# Altium schematic sheet Inputs.SchDoc
size A4; SheetNumber: 1; SheetTotal: 2
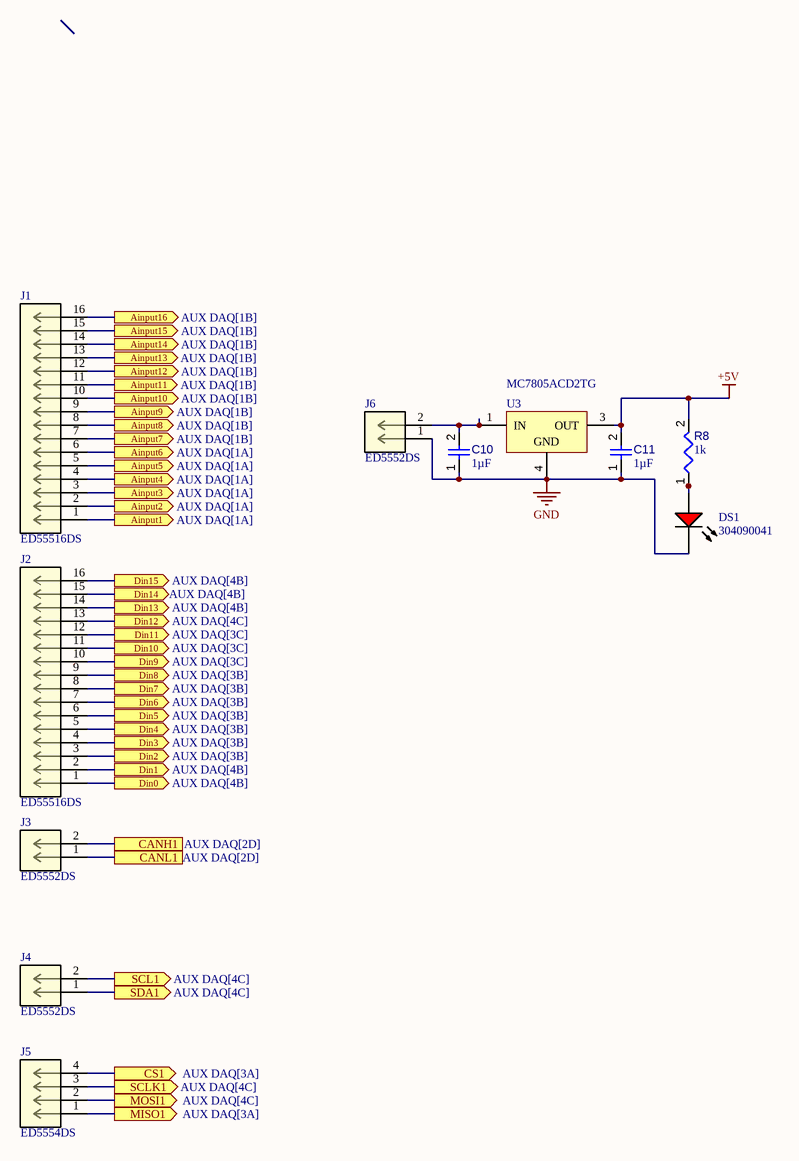
[diagram p0: Inputs.SchDoc]

## Parts
C10  value 1µF  [CAPC3216X180X20ML20]  (hidden comment: Capacitor 1 uF +/- 10% 25 V 1206)
C11  value 1µF  [CAPC3216X180X20ML20]  (hidden comment: Capacitor 1 uF +/- 10% 25 V 1206)
DS1  304090041  [LED-2P-2.28-3MM_A]  (no BOM)
J1  ED55516DS  [CONN16_ED555_56X6P5_OST]  (no BOM)
J2  ED55516DS  [CONN16_ED555_56X6P5_OST]  (no BOM)
J3  ED5552DS  [CONN_ED5552DS_OST]  (no BOM)
J4  ED5552DS  [CONN_ED5552DS_OST]  (no BOM)
J5  ED5554DS  [CONN4_ED5554DS_SHT]  (no BOM)
J6  ED5552DS  [CONN_ED5552DS_OST]
R8  value 1k  [RESC0805(2012)_L]  (hidden comment: Resistor 1K +/-5% 0805 125 mW)
U3  MC7805ACD2TG  [ONSC-D2PAK-3-936-03_V]  (no BOM)

## Ports
Ainput1 (out, see AUX DAQ[1A]), Ainput2 (out, see AUX DAQ[1A]), Ainput3 (out, see AUX DAQ[1A]), Ainput4 (out, see AUX DAQ[1A]), Ainput5 (out, see AUX DAQ[1A]), Ainput6 (out, see AUX DAQ[1A]), Ainput7 (out, see AUX DAQ[1B]), Ainput8 (out, see AUX DAQ[1B]), Ainput9 (out, see AUX DAQ[1B]), Ainput10 (out, see AUX DAQ[1B]), Ainput11 (out, see AUX DAQ[1B]), Ainput12 (out, see AUX DAQ[1B]), Ainput13 (out, see AUX DAQ[1B]), Ainput14 (out, see AUX DAQ[1B]), Ainput15 (out, see AUX DAQ[1B]), Ainput16 (out, see AUX DAQ[1B]), CANH1 (see AUX DAQ[2D]), CANL1 (see AUX DAQ[2D]), CS1 (out, see AUX DAQ[3A]), Din0 (out, see AUX DAQ[4B]), Din1 (out, see AUX DAQ[4B]), Din2 (out, see AUX DAQ[3B]), Din3 (out, see AUX DAQ[3B]), Din4 (out, see AUX DAQ[3B]), Din5 (out, see AUX DAQ[3B]), Din6 (out, see AUX DAQ[3B]), Din7 (out, see AUX DAQ[3B]), Din8 (out, see AUX DAQ[3B]), Din9 (out, see AUX DAQ[3C]), Din10 (out, see AUX DAQ[3C]), Din11 (out, see AUX DAQ[3C]), Din12 (out, see AUX DAQ[4C]), Din13 (out, see AUX DAQ[4B]), Din14 (out, see AUX DAQ[4B]), Din15 (out, see AUX DAQ[4B]), MISO1 (out, see AUX DAQ[3A]), MOSI1 (out, see AUX DAQ[4C]), SCL1 (out, see AUX DAQ[4C]), SCLK1 (out, see AUX DAQ[4C]), SDA1 (out, see AUX DAQ[4C])

## Nets
+5V: C11.2 R8.2 U3.3(OUT)
GND: C10.1 C11.1 DS1.2(K) J6.1 U3.4(GND)
Ainput1: J1.1 ; port Ainput1
Ainput2: J1.2 ; port Ainput2
Ainput3: J1.3 ; port Ainput3
Ainput4: J1.4 ; port Ainput4
Ainput5: J1.5 ; port Ainput5
Ainput6: J1.6 ; port Ainput6
Ainput7: J1.7 ; port Ainput7
Ainput8: J1.8 ; port Ainput8
Ainput9: J1.9 ; port Ainput9
Ainput10: J1.10 ; port Ainput10
Ainput11: J1.11 ; port Ainput11
Ainput12: J1.12 ; port Ainput12
Ainput13: J1.13 ; port Ainput13
Ainput14: J1.14 ; port Ainput14
Ainput15: J1.15 ; port Ainput15
Ainput16: J1.16 ; port Ainput16
CANH1: J3.2 ; port CANH1
CANL1: J3.1 ; port CANL1
CS1: J5.4 ; port CS1
Din0: J2.1 ; port Din0
Din1: J2.2 ; port Din1
Din2: J2.3 ; port Din2
Din3: J2.4 ; port Din3
Din4: J2.5 ; port Din4
Din5: J2.6 ; port Din5
Din6: J2.7 ; port Din6
Din7: J2.8 ; port Din7
Din8: J2.9 ; port Din8
Din9: J2.10 ; port Din9
Din10: J2.11 ; port Din10
Din11: J2.12 ; port Din11
Din12: J2.13 ; port Din12
Din13: J2.14 ; port Din13
Din14: J2.15 ; port Din14
Din15: J2.16 ; port Din15
MISO1: J5.1 ; port MISO1
MOSI1: J5.2 ; port MOSI1
SCL1: J4.2 ; port SCL1
SCLK1: J5.3 ; port SCLK1
SDA1: J4.1 ; port SDA1
NetC10_2: C10.2 J6.2 U3.1(IN)
NetDS1_1: DS1.1(A) R8.1

## Library data of the parts
C10 C11 = CMP-001-00006-6: Chip Capacitor, 1 uF, +/- 10%, 25 V, 1206 (3216 Metric); Capacitor Type: Ceramic; Voltage Rating: 25V; Tolerance: 10%; Min Operating Temperature: -55°C; Pins: 2; Case/Package: 1206; Max Operating Temperature: 125°C; Mounting Technology: SM; RoHS Compliant: True
DS1 = CMP-007-00007-2: Red LED, 80 mW, 30 mA, -25 to 85 degC, 2-Pin THD; Manufacturer: Shenzhen CGX; Package Description: 2-Pin Through Hole Device, Dia 3 mm, Pitch 2.28 mm; Datasheet URL: http://datasheet.octopart.com/304090041-Chengguangxing-datasheet-62330656.pdf; Mounting Technology: TH; Manufacturer URL: http://szcgx.com/; RoHS Compliant: Unknown; Datasheet Version: Sep-14; Case/Package: 304090041; Package Reference: 304090041
J1 J2 = CMP-012-000000-1: No Description Available; Mfr_Name: On Shore Technology; Type: Type; Design Item ID: ED55516DS; RefDes: RefDes; Source: ED55516DS.SchLib
J3 J4 J6 = CMP-017-000000-1: No Description Available; Mfr_Name: On Shore Technology; Type: Type; Source: ED5552DS.SchLib; Design Item ID: ED5552DS; RefDes: RefDes
J5 = CMP-014-000000-1: No Description Available; Mfr_Name: On Shore Technology; Source: ED5554DS.SchLib; Type: Wire to Board; RefDes: RefDes; Design Item ID: ED5554DS
R8 = CMP-009-00118-3: Chip Resistor, 1 kOhms, +/-5%, 125 mW, -55 to 155 degC, 0805; Tolerance: 5%; Power: 125mW; Case/Package: 0805; Pins: 2; Min Operating Temperature: -55°C; Max Operating Temperature: 155°C
U3 = CMP-019-00027-3: Positive Voltage Regulator, 5 V Output Voltage, 1 A, 0 to 125 degC, 3-Pin D2PAK (936-03), Pb-Free, Tube; Manufacturer: ON Semiconductor; Min Input Voltage: 7V; Package Version: Rev. E, 09/2015; Output Voltage: 5V; Outputs: 1; Max Input Voltage: 35V; Output Current: 1A; Dropout Voltage: 2V; Mounting Technology: SM; Package Quantity: 50; Manufacturer URL: http://www.onsemi.com/; Package Reference: D2PAK-3-936-03; Nominal Output Voltage: 5V; Packaging: Rail/Tube; Max Operating Temperature: 125°C; Datasheet URL: http://www.onsemi.com/pub_link/Collateral/MC7800-D.PDF; RoHS Compliant: True; Datasheet Version: Rev. 27, 11/2014; Case/Package: TO-263-3; Min Operating Temperature: 0°C; Max Ouput Current: 1A; Package Description: 3-Pin Flange Mount, Body 10.02 x 9.1945 mm, Pitch 2.54 mm; Package URL: http://www.onsemi.com/pub_link/Collateral/936-03.PDF; Pins: 3